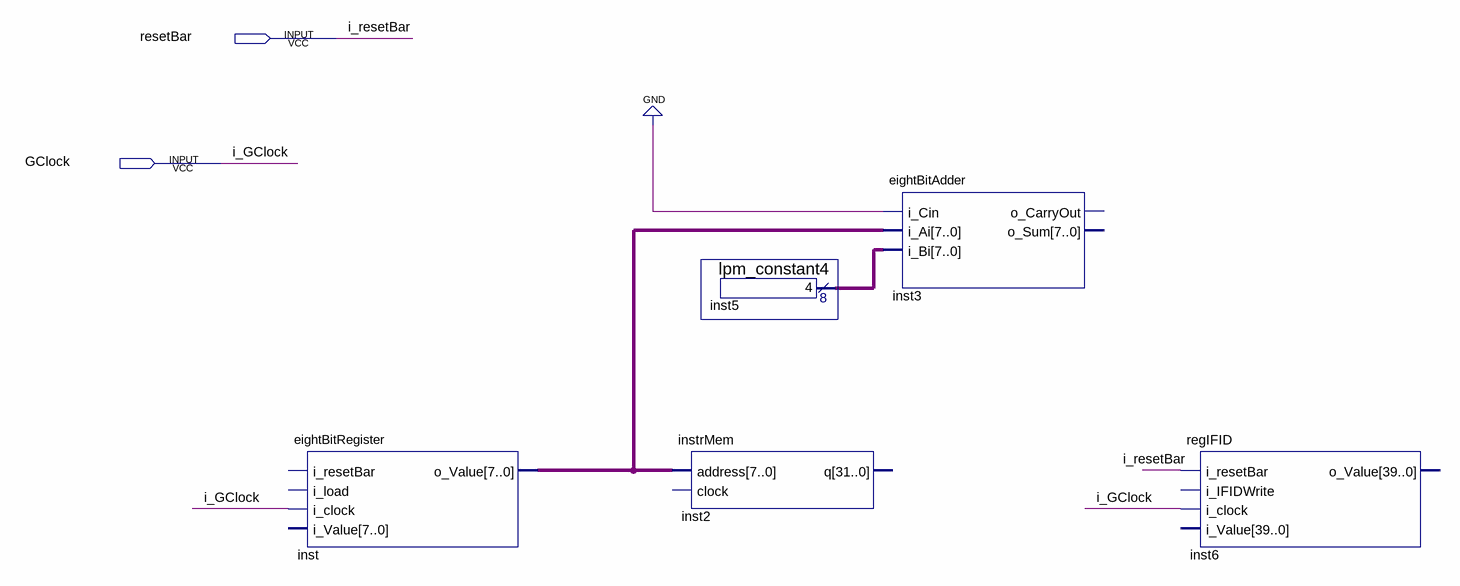
[diagram p0: schematic sheet]
// Quartus schematic pipeline.bdf as structural Verilog: 5 symbols, 2 pins
module pipeline (
  input  resetBar,
  input  GClock
);

  wire [7:0] inst5_result, inst_o_value;

  eightBitRegister inst (.i_clock(GClock), .o_Value(inst_o_value));  // open: i_resetBar, i_load, i_Value
  lpm_constant4 inst5 (.result(inst5_result));
  instrMem inst2 (.address(inst_o_value));  // open: clock, q
  eightBitAdder inst3 (.i_Cin(1'b0), .i_Ai(inst_o_value), .i_Bi(inst5_result));  // open: o_CarryOut, o_Sum
  regIFID inst6 (.i_resetBar(resetBar), .i_clock(GClock));  // open: i_IFIDWrite, i_Value, o_Value

  // Other names for the same wires on the sheet: i_GClock = GClock; i_resetBar = resetBar
endmodule
